# EAGLE design vco_main (EAGLE 7.2.0)
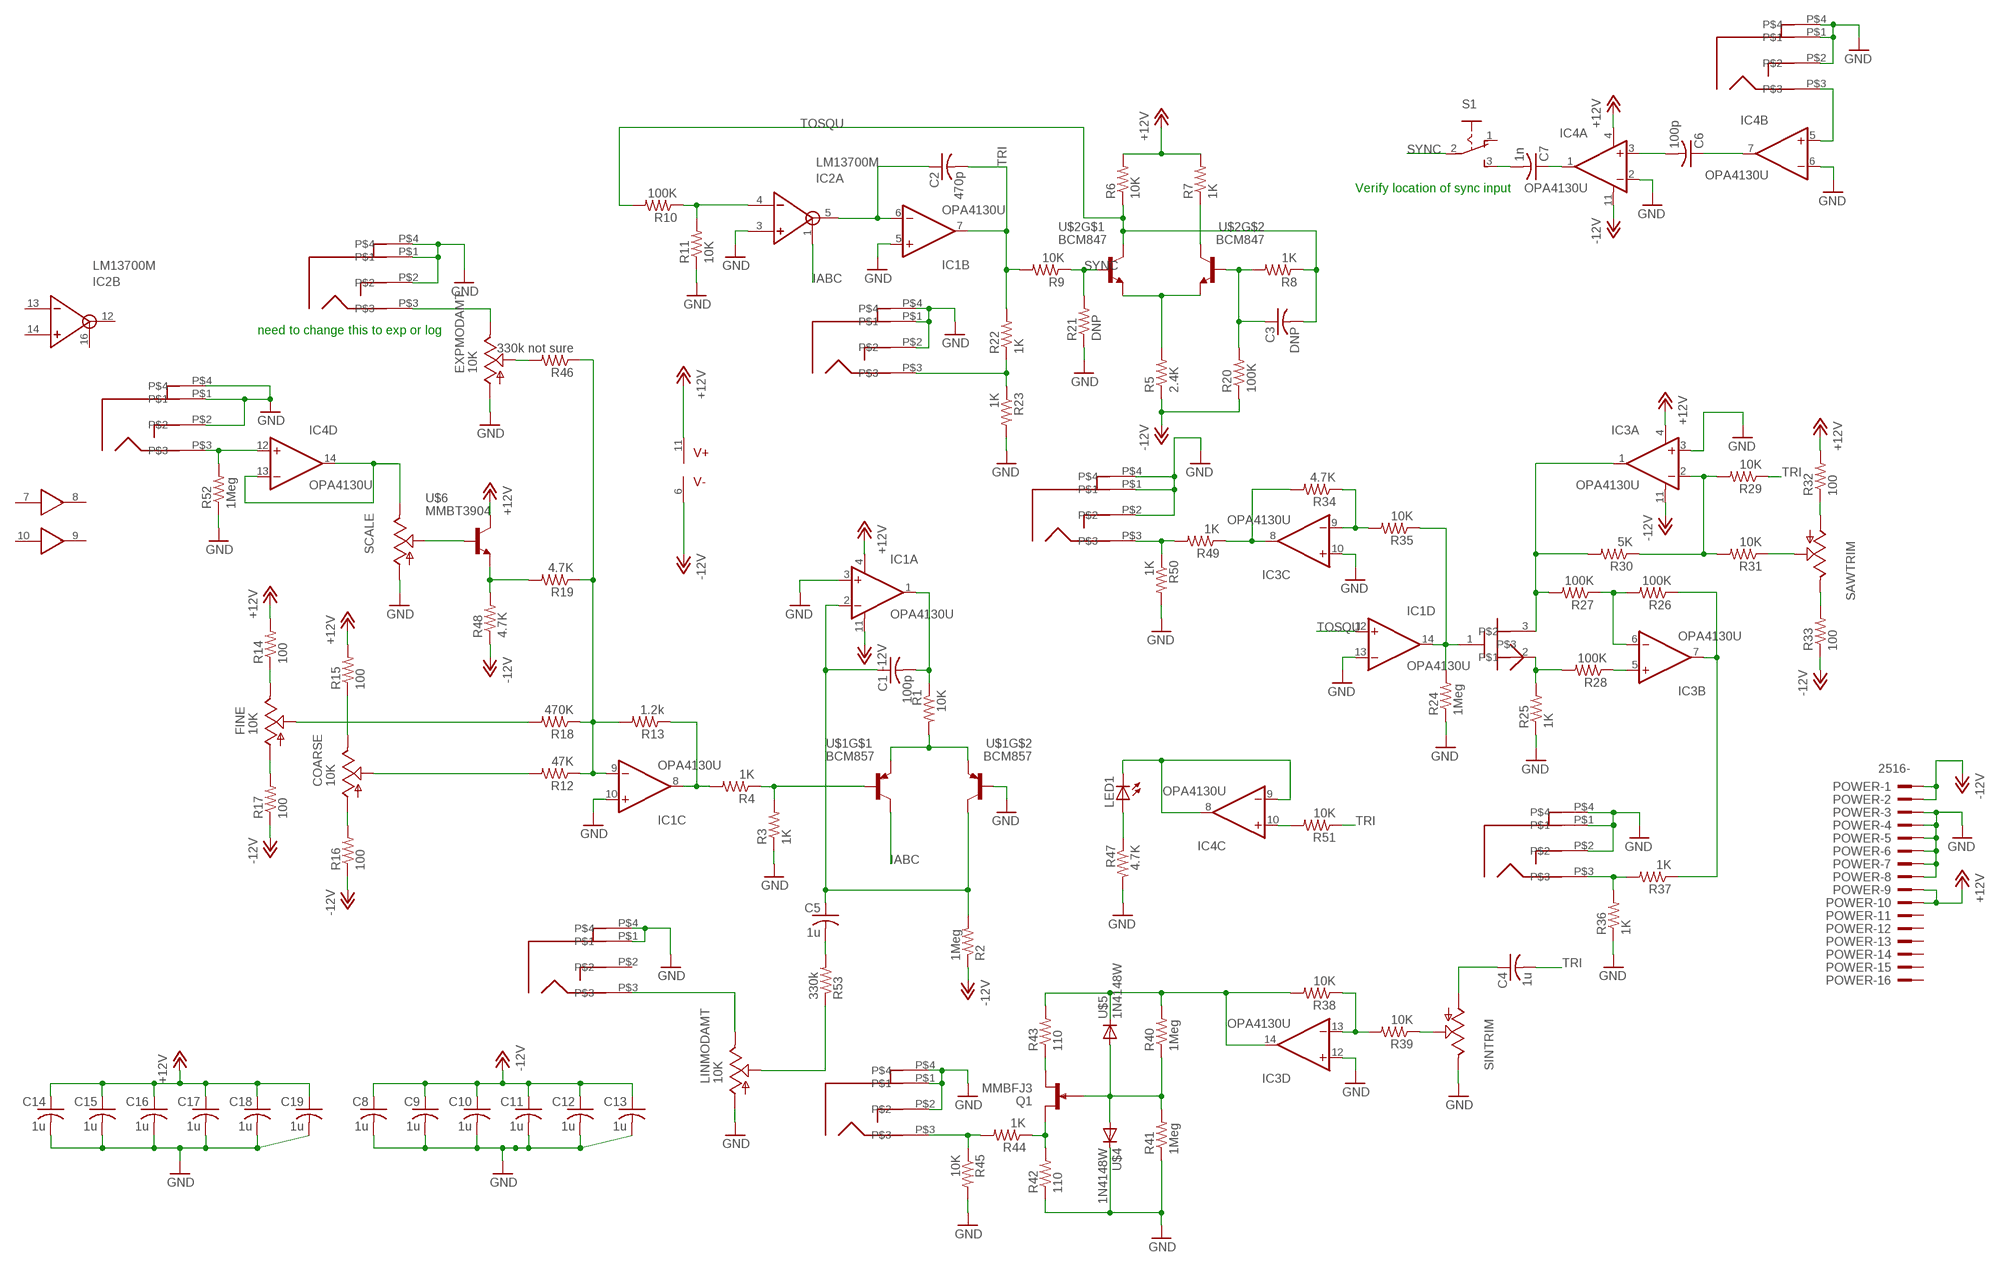
[diagram p0: schematic, sheet 1]

## Parts
C1  100p  C-USC0603  [C0603]
C2  470p  C-USC0603  [C0603]
C3  DNP  C-USC0603  [C0603]
C4  1u  C-USC0603  [C0603]
C5  1u  C-USC0603  [C0603]
C6  100p  C-USC0603  [C0603]
C7  1n  C-USC0603  [C0603]
C8  1u  C-USC0603  [C0603]
C9  1u  C-USC0603  [C0603]
C10  1u  C-USC0603  [C0603]
C11  1u  C-USC0603  [C0603]
C12  1u  C-USC0603  [C0603]
C13  1u  C-USC0603  [C0603]
C14  1u  C-USC0603  [C0603]
C15  1u  C-USC0603  [C0603]
C16  1u  C-USC0603  [C0603]
C17  1u  C-USC0603  [C0603]
C18  1u  C-USC0603  [C0603]
C19  1u  C-USC0603  [C0603]
COARSE  10K  US-EVUF2J  [EVUFXJ]
EXPMOD  PJ301BM  [PJ301BM]
EXPMODAMT  10K  US-EVUF2J  [EVUFXJ]
FINE  10K  US-EVUF2J  [EVUFXJ]
IC1  OPA4130U  [SO14]
IC2  LM13700M  [SO16]
IC3  OPA4130U  [SO14]
IC4  OPA4130U  [SO14]
LED1  LED5MM  [LED5MM]
LINMOD  PJ301BM  [PJ301BM]
LINMODAMT  10K  US-EVUF2J  [EVUFXJ]
POWER  2516-  [PAK100/2500-16]
Q1  MMBFJ3  [SOT23]
R1  10K  R-US_R0603  [R0603]
R2  1Meg  R-US_R0603  [R0603]
R3  1K  R-US_R0603  [R0603]
R4  1K  R-US_R0603  [R0603]
R5  2.4K  R-US_R0603  [R0603]
R6  10K  R-US_R0603  [R0603]
R7  1K  R-US_R0603  [R0603]
R8  1K  R-US_R0603  [R0603]
R9  10K  R-US_R0603  [R0603]
R10  100K  R-US_R0603  [R0603]
R11  10K  R-US_R0603  [R0603]
R12  47K  R-US_R0603  [R0603]
R13  1.2k  R-US_R0603  [R0603]
R14  100  R-US_R0603  [R0603]
R15  100  R-US_R0603  [R0603]
R16  100  R-US_R0603  [R0603]
R17  100  R-US_R0603  [R0603]
R18  470K  R-US_R0603  [R0603]
R19  4.7K  R-US_R0603  [R0603]
R20  100K  R-US_R0603  [R0603]
R21  DNP  R-US_R0603  [R0603]
R22  1K  R-US_R0603  [R0603]
R23  1K  R-US_R0603  [R0603]
R24  1Meg  R-US_R0603  [R0603]
R25  1K  R-US_R0603  [R0603]
R26  100K  R-US_R0603  [R0603]
R27  100K  R-US_R0603  [R0603]
R28  100K  R-US_R0603  [R0603]
R29  10K  R-US_R0603  [R0603]
R30  5K  R-US_R0603  [R0603]
R31  10K  R-US_R0603  [R0603]
R32  100  R-US_R0603  [R0603]
R33  100  R-US_R0603  [R0603]
R34  4.7K  R-US_R0603  [R0603]
R35  10K  R-US_R0603  [R0603]
R36  1K  R-US_R0603  [R0603]
R37  1K  R-US_R0603  [R0603]
R38  10K  R-US_R0603  [R0603]
R39  10K  R-US_R0603  [R0603]
R40  1Meg  R-US_R0603  [R0603]
R41  1Meg  R-US_R0603  [R0603]
R42  110  R-US_R0603  [R0603]
R43  110  R-US_R0603  [R0603]
R44  1K  R-US_R0603  [R0603]
R45  10K  R-US_R0603  [R0603]
R46  330k not sure  R-US_R0603  [R0603]
R47  4.7K  R-US_R0603  [R0603]
R48  4.7K  R-US_R0603  [R0603]
R49  1K  R-US_R0603  [R0603]
R50  1K  R-US_R0603  [R0603]
R51  10K  R-US_R0603  [R0603]
R52  1Meg  R-US_R0603  [R0603]
R53  330k  R-US_R0603  [R0603]
S1  255SB  [255SB]
SAW  PJ301BM  [PJ301BM]
SAWTRIM  TRIM_US-B64Y  [B64Y]
SCALE  TRIM_US-B64Y  [B64Y]
SIN  PJ301BM  [PJ301BM]
SINTRIM  TRIM_US-B64Y  [B64Y]
SQUARE  PJ301BM  [PJ301BM]
SYNC  PJ301BM  [PJ301BM]
TRIOUT  PJ301BM  [PJ301BM]
U$1  BCM857  [SOT457R_PHILIPS]
U$2  BCM847  [SOT457R_PHILIPS]
U$3  2N7000  [SOT23]
U$4  1N4148W  [SOD123]
U$5  1N4148W  [SOD123]
U$6  MMBT3904  [SOT23]
VPEROCT  PJ301BM  [PJ301BM]

## Nets
+12V: C14.1 C15.1 C16.1 C17.1 C18.1 C19.1 IC1.4(A:V+) IC2.11(V+) IC3.4(A:V+) IC4.4(A:V+) POWER.9 POWER.10 R6.2 R7.2 R14.2 R15.2 R32.2 U$6.3(C)
-12V: C8.1 C9.1 C10.1 C11.1 C12.1 C13.1 IC1.11(A:V-) IC2.6(V-) IC3.11(A:V-) IC4.11(A:V-) POWER.1 POWER.2 R2.1 R5.1 R16.1 R17.1 R20.1 R33.1 R48.1
GND: C8.2 C9.2 C10.2 C11.2 C12.2 C13.2 C14.2 C15.2 C16.2 C17.2 C18.2 C19.2 EXPMOD.P$1 EXPMOD.P$2 EXPMOD.P$4 EXPMODAMT.1(A) IC1.3(A:+IN) IC1.5(B:+IN) IC1.10(C:+IN) IC1.13(D:-IN) IC2.3(A:+IN) IC3.3(A:+IN) IC3.10(C:+IN) IC3.12(D:+IN) IC4.2(A:-IN) IC4.6(B:-IN) LINMOD.P$1 LINMOD.P$4 LINMODAMT.1(A) POWER.3 POWER.4 POWER.5 POWER.6 POWER.7 POWER.8 R3.1 R11.1 R21.1 R23.2 R24.1 R25.1 R36.1 R41.1 R42.1 R45.2 R47.2 R50.2 R52.1 SAW.P$1 SAW.P$2 SAW.P$4 SCALE.A SIN.P$1 SIN.P$2 SIN.P$4 SINTRIM.E SQUARE.P$1 SQUARE.P$2 SQUARE.P$4 SYNC.P$1 SYNC.P$2 SYNC.P$4 TRIOUT.P$1 TRIOUT.P$2 TRIOUT.P$4 U$1.5(B) U$4.C VPEROCT.P$1 VPEROCT.P$2 VPEROCT.P$4
IABC: IC2.1(A:IABC) U$1.6(C)
N$1: LED1.A R47.1
N$2: C1.2 IC1.1(A:OUT) R1.1
N$3: C1.1 C5.1 IC1.2(A:-IN) R2.2 U$1.3(C)
N$4: C3.1 R8.2 R20.2 U$2.5(B)
N$5: IC1.9(C:-IN) R12.1 R13.2 R18.1 R19.1 R46.1
N$6: C6.2 IC4.3(A:+IN)
N$7: R3.2 R4.1 U$1.2(B)
N$8: FINE.3(E) R14.1
N$9: R49.2 R50.1 SQUARE.P$3
N$10: R25.2 R28.2 U$3.2
N$11: R5.2 U$2.1(E) U$2.4(E)
N$12: R1.2 U$1.1(E) U$1.4(E)
N$13: R22.1 R23.1 TRIOUT.P$3
N$14: IC2.4(A:-IN) R10.1 R11.2
N$15: IC1.8(C:OUT) R4.2 R13.1
N$16: COARSE.3(E) R15.1
N$17: COARSE.1(A) R16.2
N$18: COARSE.2(S) R12.2
N$19: C2.1 IC1.6(B:-IN) IC2.5(A:OUT)
N$20: FINE.1(A) R17.2
N$21: FINE.2(S) R18.2
N$22: R19.2 R48.2 U$6.2(E)
N$23: R7.1 U$2.3(C)
N$24: LINMOD.P$3 LINMODAMT.3(E)
N$25: IC3.5(B:+IN) R28.1
N$26: IC3.6(B:-IN) R26.2 R27.1
N$27: IC3.7(B:OUT) R26.1 R37.1
N$28: IC3.1(A:OUT) R27.2 R30.2 U$3.3
N$29: R32.1 SAWTRIM.A
N$30: IC3.2(A:-IN) R29.2 R30.1 R31.2
N$31: R33.2 SAWTRIM.E
N$32: R31.1 SAWTRIM.S
N$33: R36.2 R37.2 SAW.P$3
N$34: IC3.9(C:-IN) R34.1 R35.2
N$35: C4.1 SINTRIM.A
N$36: IC3.8(C:OUT) R34.2 R49.1
N$37: Q1.3(G) R40.1 R41.2 U$4.A U$5.A
N$38: IC3.13(D:-IN) R38.1 R39.2
N$39: R39.1 SINTRIM.S
N$40: R44.2 R45.1 SIN.P$3
N$41: IC3.14(D:OUT) R38.2 R40.2 R43.2 U$5.C
N$42: EXPMODAMT.2(S) R46.2
N$43: Q1.1(D) R42.2 R44.1
N$44: Q1.2(S) R43.1
N$45: EXPMOD.P$3 EXPMODAMT.3(E)
N$46: LINMODAMT.2(S) R53.1
N$47: C6.1 IC4.7(B:OUT)
N$48: C5.2 R53.2
N$49: C7.1 IC4.1(A:OUT)
N$50: IC4.5(B:+IN) SYNC.P$3
N$51: C7.2 S1.3(S)
N$52: IC4.8(C:OUT) IC4.9(C:-IN) LED1.K(C)
N$54: IC4.12(D:+IN) R52.2 VPEROCT.P$3
N$55: IC4.13(D:-IN) IC4.14(D:OUT) SCALE.E
N$56: SCALE.S U$6.1(B)
N$57: IC1.14(D:OUT) R24.2 R35.1 U$3.1
N$59: IC4.10(C:+IN) R51.2
SYNC: R9.1 R21.2 S1.2(P) U$2.2(B)
TOSQU: C3.2 IC1.12(D:+IN) R6.1 R8.1 R10.2 U$2.6(C)
TRI: C2.2 C4.2 IC1.7(B:OUT) R9.2 R22.2 R29.1 R51.1
Unconnected: IC2.7(IN) IC2.8(OUT) IC2.9(OUT) IC2.10(IN) IC2.12(B:OUT) IC2.13(B:-IN) IC2.14(B:+IN) IC2.16(B:IABC) LINMOD.P$2 POWER.11 POWER.12 POWER.13 POWER.14 POWER.15 POWER.16 S1.1(O)

## Notes on the sheet
- Verify location of sync input
- need to change this to exp or log

## Library data of the parts
C1-C19 = dan:C-US: CAPACITOR, American symbol
COARSE EXPMODAMT FINE LINMODAMT = dan:US-EVU: 9 mm Square Rotary Potentiometers Source: Panasonic
EXPMOD LINMOD SAW SIN SQUARE SYNC TRIOUT VPEROCT = dan:PJ301BM
IC1 IC3 IC4 = dan:OPA4130: Low Power, Precision FET-Input Operational Amplifiers; MF: TEXAS INSTRUMENTS; MPN: OPA4130UA; OC_FARNELL: 1648707; OC_NEWARK: 80K8080
IC2 = dan:LM13700: National Dual OTA with buffers.
LED1 = dan:LED: LED OSRAM: - CHIPLED LG R971, LG N971, LY N971, LG Q971, LY Q971, LO R971, LY R971 LH N974, LH R974 LS Q976, LO Q976, LY Q976 LO Q996 - Hyper CHIPLED LW Q18S LB Q993, LB Q99A, LB R99A - SideLED LS A670, LO A670, LY A670, LG A670, LP A670 LB A673, LV A673, LT A673, LW A673 LH A674 LY A675 LS A676, LA A676, LO A676, LY A676, LW A676 LS A679, LY A679, LG A679 - Hyper Micro SIDELED® LS Y876, LA Y876, LO Y876, LY Y876 LT Y87S - SmartLED LW L88C, LW L88S LB L89C, LB L89S, LG L890 LS L89K, LO L89K, LY L89K LS L896, LA L896, LO L896, LY L896 - TOPLED LS T670, LO T670, LY T670, LG T670, LP T670 LSG T670, LSP T670, LSY T670, LOP T670, LYG T670 LG T671, LOG T671, LSG T671 LB T673, LV T673, LT T673, LW T673 LH T674 LS T676, LA T676, LO T676, LY T676, LB T676, LH T676, LSB T676, LW T676 LB T67C, LV T67C, LT T67C, LS T67K, LO T67K, LY T67K, LW E67C LS E67B, LA E67B, LO E67B, LY E67B, LB E67C, LV E67C, LT E67C LW T67C LS T679, LY T679, LG T679 LS T770, LO T770, LY T770, LG T770, LP T770 LB T773, LV T773, LT T773, LW T773 LH T774 LS E675, LA E675, LY E675, LS T675 LS T776, LA T776, LO T776, LY T776, LB T776 LHGB T686 LT T68C, LB T68C - Hyper Mini TOPLED® LB M676 - Mini TOPLED Santana® LG M470 LS M47K, LO M47K, LY M47K Source: http://www.osram.convergy.de LUXEON: - LUMILED® LXK2-PW12-R00, LXK2-PW12-S00, LXK2-PW14-U00, LXK2-PW14-V00 LXK2-PM12-R00, LXK2-PM12-S00, LXK2-PM14-U00 LXK2-PE12-Q00, LXK2-PE12-R00, LXK2-PE12-S00, LXK2-PE14-T00, LXK2-PE14-U00 LXK2-PB12-K00, LXK2-PB12-L00, LXK2-PB12-M00, LXK2-PB14-N00, LXK2-PB14-P00, LXK2-PB14-Q00 LXK2-PR12-L00, LXK2-PR12-M00, LXK2-PR14-Q00, LXK2-PR14-R00 LXK2-PD12-Q00, LXK2-PD12-R00, LXK2-PD12-S00 LXK2-PH12-R00, LXK2-PH12-S00 LXK2-PL12-P00, LXK2-PL12-Q00, LXK2-PL12-R00 Source: www.luxeon.com KINGBRIGHT: KA-3528ASYC Source: www.kingbright.com
POWER = dan:2516-: 3M (TM) Pak 100 4-Wall Header Source: 3M; OC_FARNELL: unknown; OC_NEWARK: unknown
Q1 = dan:MMBFJ3*: N-Channel RF Amplifier Source: http://www.fairchildsemi.com/pf/J3/J310.html
R1-R53 = dan:R-US_: RESISTOR, American symbol
S1 = dan:255SB: SLIDING SWITCH Distributor Buerklin, 11G810
SAWTRIM SCALE SINTRIM = dan:TRIM_US-: POTENTIOMETER
U$1 = dan:BCM857
U$2 = dan:BCM847
U$3 = dan:2N7000
U$4 U$5 = dan:1N4148W
U$6 = dan:MMBT3904

## Board
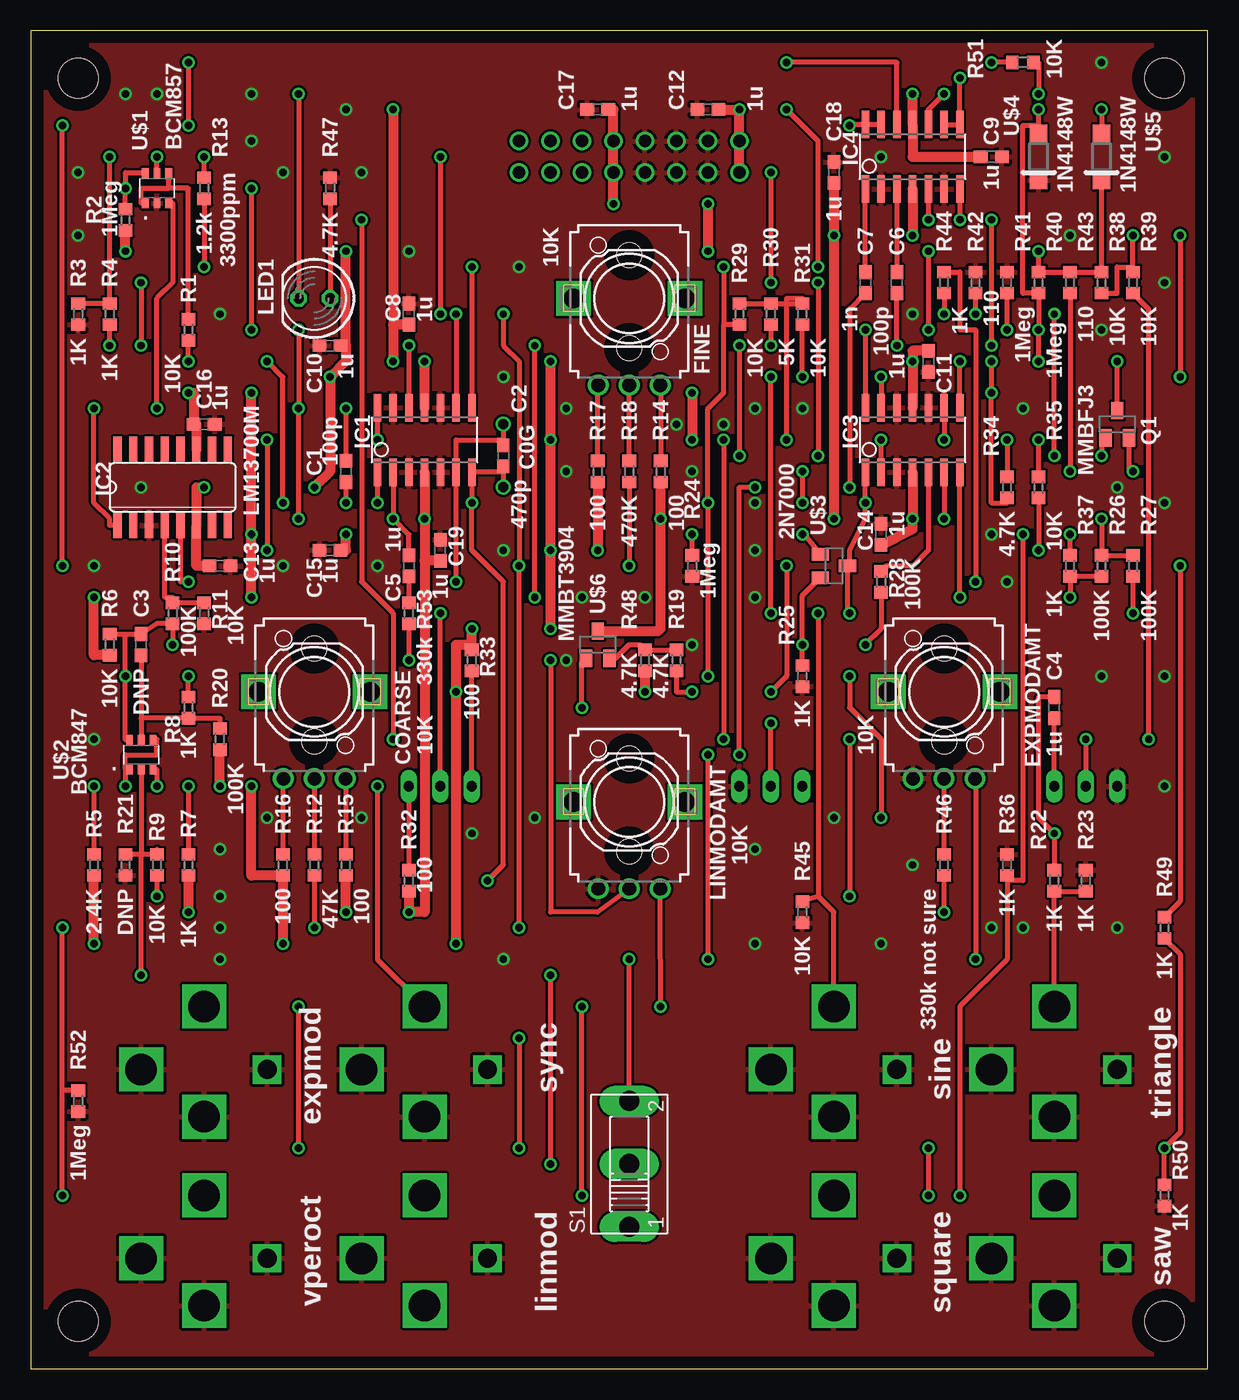
[diagram p1: board, top side]
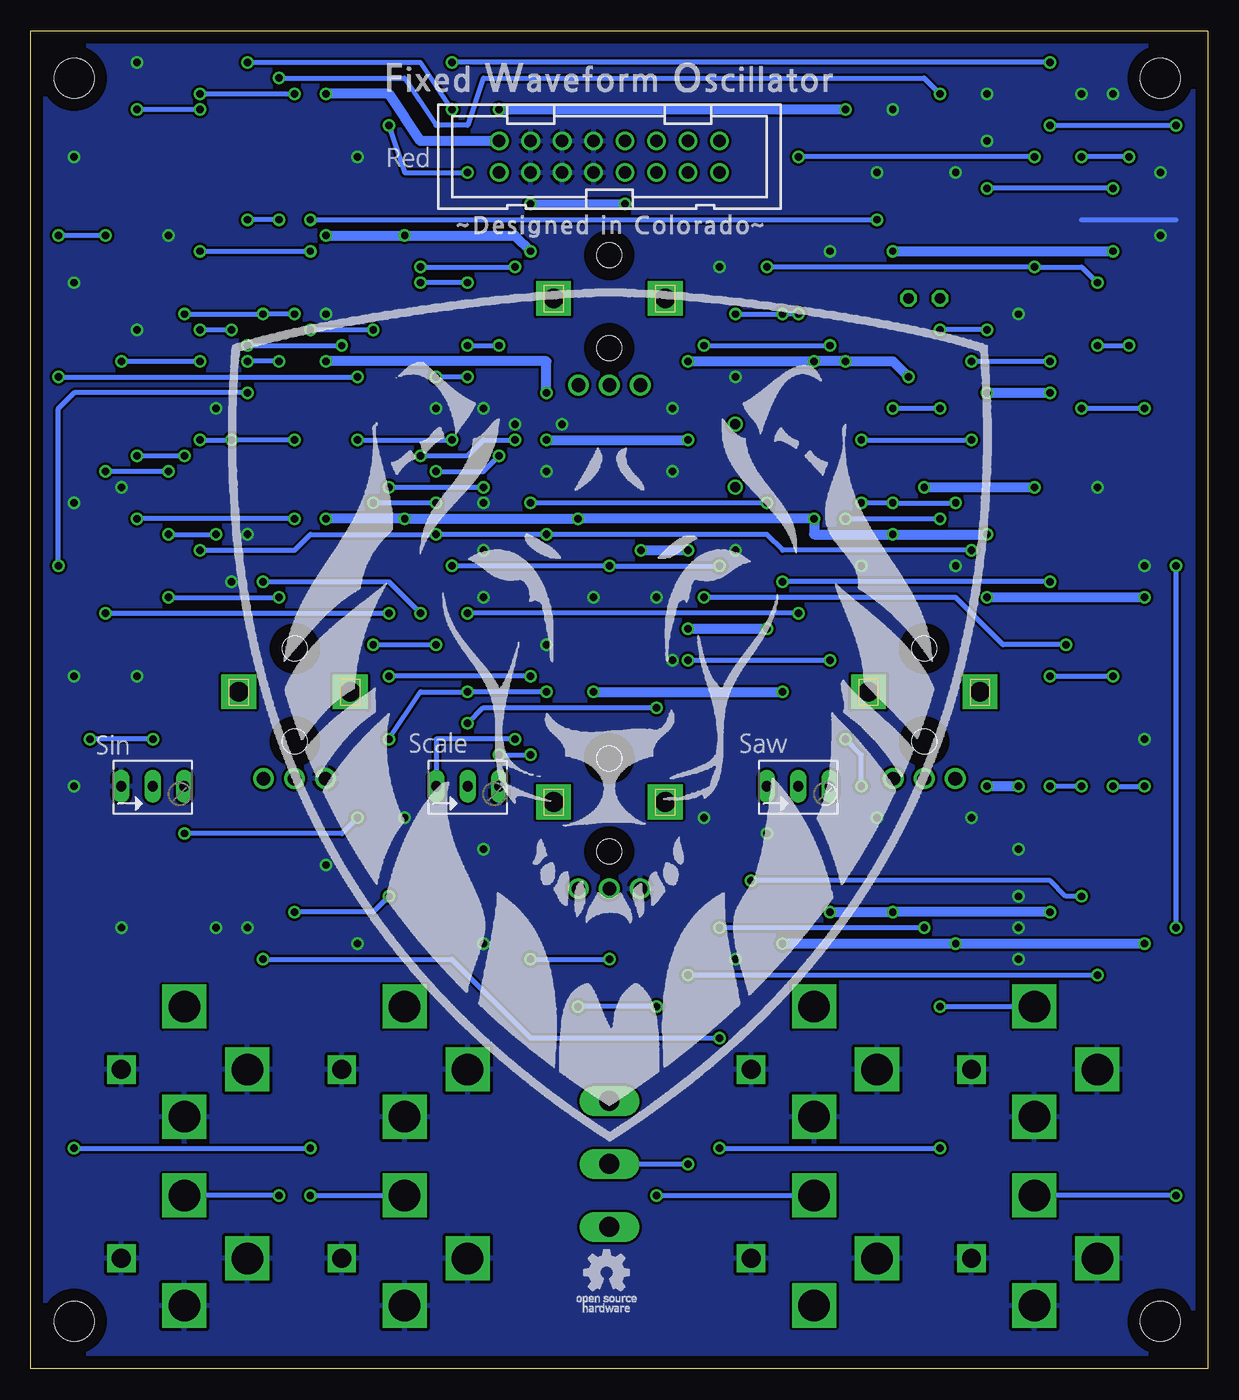
[diagram p2: board, bottom side, seen from below]

Size 94.92 x 107.94 mm. Coordinates in mm from the lower left corner, seen from the top.
Outline: 0,107.94 94.92,107.94 94.92,0 0,0 0,107.94
Copper layers (1*16): Top 0.035mm / dielectric 1.5mm / Bottom 0.035mm
Design rules "default *": minimum track width 10mil, minimum drill 20mil, track to track 8mil, track to pad 8mil, pad to pad 8mil, via to via 8mil, smd to smd 8mil, copper to edge 40mil, drill to drill 8mil, minimum pad ring 10mil, minimum via ring 8mil, stop-mask expansion 4mil, vias tented up to drill 0mil, thermal gap 10mil
Holes 3.2 mm at 3.81,3.81 91.44,3.81 3.81,104.14 91.44,104.14

### Footprints (pad centres in the part's own frame; a part is rotated, then mirrored left to right if it is on the bottom)
C0603 = smd 1.1 x 1: 1 -0.85,0; 2 0.85,0
EVUFXJ = drill 1.1 pad 1.676: 1 -2.5,-7; 2 0,-7; 3 2.5,-7 | drill 1.6 pad 2.8 square: M1 4.5,0; M2 -4.5,0 | hole 2: 0,3.5; 0,-4
PJ301BM = drill 1.524 square: P$1 5.08,0 | drill 2.54 square: P$2 0,-3.81; P$3 0,5.08; P$4 -5.08,0
SO14 = smd 0.61 x 2.21: 1 -3.81,-2.603; 2 -2.54,-2.603; 3 -1.27,-2.603; 4 0,-2.603; 5 1.27,-2.603; 6 2.54,-2.603; 7 3.81,-2.603; 8 3.81,2.603; 9 2.54,2.603; 10 1.27,2.603; 11 0,2.603; 12 -1.27,2.603; 13 -2.54,2.603; 14 -3.81,2.603
SO16 = smd 0.66 x 2.032: 1 -4.445,-3.073; 2 -3.175,-3.073; 3 -1.905,-3.073; 4 -0.635,-3.073; 5 0.635,-3.073; 6 1.905,-3.073; 7 3.175,-3.073; 8 4.445,-3.073; 9 4.445,3.073; 10 3.175,3.073; 11 1.905,3.073; 12 0.635,3.073; 13 -0.635,3.073; 14 -1.905,3.073; 15 -3.175,3.073; 16 -4.445,3.073
LED5MM = drill 0.813 octagon: A -1.27,0; K 1.27,0
PAK100/2500-16 = drill 1 pad 1.422: 1 -8.89,-1.27; 2 -8.89,1.27; 3 -6.35,-1.27; 4 -6.35,1.27; 5 -3.81,-1.27; 6 -3.81,1.27; 7 -1.27,-1.27; 8 -1.27,1.27; 9 1.27,-1.27; 10 1.27,1.27; 11 3.81,-1.27; 12 3.81,1.27; 13 6.35,-1.27; 14 6.35,1.27; 15 8.89,-1.27; 16 8.89,1.27
SOT23 = smd 1 x 1.4: 1 -0.95,-1.1; 2 0.95,-1.1; 3 0,1.1
R0603 = smd 1 x 1.1: 1 -0.85,0; 2 0.85,0
255SB = drill 1.6 long: 1 -5.08,0; 2 0,0; 3 5.08,0
B64Y = drill 0.813 long: A 2.54,0; E -2.54,0; S 0,0
SOT457R_PHILIPS = smd 0.55 x 0.8: 1 -0.95,-1.2; 2 0,-1.2; 3 0.95,-1.2; 4 0.95,1.2; 5 0,1.2; 6 -0.95,1.2
SOD123 = smd 1.4 x 1.4: A 1.9,0; C -1.9,0

### Placement (x,y rotation side)
C1  25.4,72.39 270 top
C2  38.1,73.66 270 top
C3  8.89,58.42 90 top
C4  82.55,53.34 90 top
C5  30.48,64.77 270 top
C6  69.85,87.63 90 top
C7  67.31,87.63 270 top
C8  30.48,85.09 90 top
C9  77.47,97.79 0 top
C10  24.13,82.55 180 top
C11  72.39,81.28 270 top
C12  54.61,101.6 180 top
C13  15.24,64.77 0 top
C14  68.58,67.31 90 top
C15  24.13,66.04 180 top
C16  13.97,76.2 0 top
C17  45.72,101.6 180 top
C18  64.77,96.52 90 top
C19  33.02,66.04 90 top
COARSE  22.86,54.61 0 top
EXPMOD  13.97,24.13 0 top
EXPMODAMT  73.66,54.61 0 top
FINE  48.26,86.36 0 top
IC1  31.75,74.93 0 top
IC2  11.43,71.12 0 top
IC3  71.12,74.93 0 top
IC4  71.12,97.79 0 top
LED1  22.86,86.36 180 top
LINMOD  31.75,8.89 0 top
LINMODAMT  48.26,45.72 0 top
POWER  48.26,97.79 0 bottom
Q1  87.63,76.2 0 top
R1  12.7,83.82 90 top
R2  7.62,92.71 90 top
R3  3.81,85.09 90 top
R4  6.35,85.09 270 top
R5  5.08,40.64 90 top
R6  6.35,58.42 270 top
R7  12.7,40.64 270 top
R8  12.7,53.34 270 top
R9  10.16,40.64 270 top
R10  11.43,60.96 270 top
R11  13.97,60.96 90 top
R12  22.86,40.64 90 top
R13  13.97,95.25 90 top
R14  50.8,72.39 270 top
R15  25.4,40.64 270 top
R16  20.32,40.64 90 top
R17  45.72,72.39 90 top
R18  48.26,72.39 90 top
R19  52.07,57.15 90 top
R20  15.24,50.8 90 top
R21  7.62,40.64 90 top
R22  82.55,39.37 90 top
R23  85.09,39.37 90 top
R24  53.34,64.77 90 top
R25  62.23,55.88 90 top
R26  86.36,64.77 90 top
R27  88.9,64.77 270 top
R28  68.58,63.5 270 top
R29  57.15,85.09 90 top
R30  59.69,85.09 270 top
R31  62.23,85.09 90 top
R32  30.48,39.37 270 top
R33  35.56,57.15 270 top
R34  78.74,71.12 270 top
R35  81.28,71.12 90 top
R36  78.74,40.64 270 top
R37  83.82,64.77 90 top
R38  86.36,87.63 90 top
R39  88.9,87.63 90 top
R40  81.28,87.63 90 top
R41  78.74,87.63 270 top
R42  76.2,87.63 270 top
R43  83.82,87.63 90 top
R44  73.66,87.63 90 top
R45  62.23,36.83 270 top
R46  73.66,40.64 90 top
R47  24.13,95.25 90 top
R48  49.53,57.15 90 top
R49  91.44,35.56 270 top
R50  91.44,13.97 270 top
R51  80.01,105.41 0 top
R52  3.81,21.59 90 top
R53  30.48,60.96 90 top
S1  48.26,16.51 90 top
SAW  82.55,8.89 0 top
SAWTRIM  33.02,46.99 0 bottom
SCALE  59.69,46.99 0 bottom
SIN  64.77,24.13 0 top
SINTRIM  85.09,46.99 0 bottom
SQUARE  64.77,8.89 0 top
SYNC  31.75,24.13 0 top
TRIOUT  82.55,24.13 0 top
U$1  10.16,95.25 180 top
U$2  8.89,49.53 0 top
U$3  64.77,64.77 270 top
U$4  81.28,97.79 90 top
U$5  86.36,97.79 90 top
U$6  45.72,58.42 0 top
VPEROCT  13.97,8.89 0 top

### Tracks (layer width: path | path; a pad name or v marks a point on that pad's centre or on a via)
+12V  (via drill 0.6)
  Top 0.406: C15.1 25.4,66.04 | C16.1 13.34,76.2 | v12.7,78.74 13.12,78.74 | 50.63,59.52 50.8,59.69
  Top 0.813: IC1.4 v31.75,68.58 31.75,65.19 | R14.2 v50.8,68.58 50.8,59.69 | IC3.4 v71.12,68.58 71.12,67.73 C14.1 | IC4.4 v71.12,91.44 | v64.77,68.58 v64.77,91.44 C18.1 | 31.75,65.19 31.75,36.83 v30.48,36.83 R32.2 | v25.4,36.83 R15.2 | R7.2 v12.7,36.83 | v46.99,93.98 POWER.9 POWER.10 46.99,101.6 C17.1 | 25.4,66.04 v25.4,67.31 | C19.1 31.75,65.19 | 13.34,76.2 IC2.11 | v17.78,78.74 v17.78,67.31 v17.78,62.23 | 13.12,78.74 C16.1 | v54.61,93.98 v54.61,90.17 | R6.2 5.08,57.57 v5.08,62.23 | U$6.3 50.63,59.52
  Bottom 0.813: v71.12,91.44 v64.77,91.44 55.88,91.44 v54.61,90.17 | v71.12,68.58 v64.77,68.58 v50.8,68.58 v31.75,68.58 31.75,67.31 v25.4,67.31 v17.78,67.31 | v30.48,36.83 v25.4,36.83 v12.7,36.83 | v54.61,93.98 v46.99,93.98 | v17.78,78.74 v12.7,78.74 | v5.08,62.23 v17.78,62.23
-12V  (via drill 0.6)
  Top 0.406: v13.97,71.12 13.34,71.12 | C10.1 25.4,82.55 | 20.32,38.1 R16.1
  Top 0.813: IC1.11 v31.75,81.28 | IC3.11 v71.12,81.28 71.12,82.13 C11.1 | v5.08,34.29 R5.1 | v20.32,34.29 R16.1 17.78,39.79 v17.78,46.99 | R33.1 35.56,58.42 | 35.56,58.42 v35.56,59.69 | v41.91,59.69 v41.91,66.04 v41.91,74.93 v41.91,81.28 | v71.12,102.87 IC4.11 71.12,97.79 C9.1 | v29.21,101.6 29.21,84.24 | 29.21,84.24 v29.21,81.28 | v34.29,34.29 v34.29,54.61 34.29,58.42 35.56,58.42 | v53.34,78.74 v53.34,74.93 | POWER.1 POWER.2 v57.15,101.6 C12.1 | C8.1 29.21,84.24 | 13.34,71.12 IC2.6 13.34,64.77 C13.1 | v25.4,90.17 25.4,82.55 25.4,81.28 v24.13,80.01 24.13,72.39 v22.86,71.12 | v7.62,90.17 R2.1 | v15.24,46.99 R20.1 | R17.1 v45.72,66.04 | R48.1 v49.53,54.61
  Bottom 0.813: v5.08,34.29 v20.32,34.29 v34.29,34.29 | v35.56,59.69 v41.91,59.69 | v41.91,81.28 v31.75,81.28 v29.21,81.28 25.4,81.28 v24.13,80.01 | v53.34,74.93 v41.91,74.93 | v22.86,71.12 v13.97,71.12 | v25.4,90.17 v7.62,90.17 | v29.21,101.6 v57.15,101.6 | v53.34,78.74 53.34,81.28 v71.12,81.28 | v15.24,46.99 v17.78,46.99 | v45.72,66.04 v41.91,66.04 | POWER.2 63.5,99.06 66.04,102.87 v71.12,102.87 | v49.53,54.61 v34.29,54.61
GND  (via drill 0.6)
  Top 0.406: R3.1 3.81,83.82
  Bottom 0.406: 10.16,92.71 2.54,92.71
  other vias: 58.42,77.47 62.23,77.47 30.48,90.17 86.36,83.82 35.56,43.18 55.88,76.2 38.1,80.01 39.37,88.9 25.4,101.6 17.78,102.87 10.16,102.87 3.81,96.52 3.81,91.44 91.44,97.79 86.36,105.41 83.82,91.44 77.47,35.56 86.36,55.88 40.64,44.45 44.45,62.23 49.53,62.23 5.08,50.8 80.01,35.56 53.34,72.39 80.01,77.47 52.07,76.2 26.67,44.45 19.05,44.45 17.78,99.06 26.67,96.52 8.89,71.12 68.58,97.79 20.32,96.52 15.24,85.09 7.62,102.87 77.47,67.31 58.42,69.85 20.32,64.77 27.94,64.77 71.12,40.64 5.08,64.77 58.42,66.04 58.42,62.23 78.74,63.5 43.18,77.47 43.18,72.39 91.44,46.99 71.12,85.09 87.63,71.12 53.34,58.42 43.18,57.15 38.1,66.04 91.44,69.85 91.44,55.88 58.42,41.91 68.58,34.29 15.24,41.91 91.44,87.63 15.24,33.02 15.24,35.56 15.24,38.1 64.77,44.45 58.42,34.29 38.1,33.02 87.63,35.56
  pour Top: -3.81,107.95 100.33,109.22 97.79,-2.54 -5.08,-3.81
  pour Bottom: -7.62,109.22 97.79,110.49 103.05,-4.31 -12.7,-8.89
IABC  (via drill 0.6)
  Top 0.406: IC2.1 6.35,68.05 6.35,68.58 5.08,69.85 v5.08,77.47 | v10.16,77.47 10.16,86.36 11.43,87.63 11.43,94.05 U$1.6
  Bottom 0.406: v5.08,77.47 v10.16,77.47
N$1
  Top 0.406: R47.1 LED1.A
N$2  (via drill 0.6)
  Top 0.406: IC1.1 v27.94,69.85 | C1.2 v25.4,69.85 | v20.32,69.85 20.32,80.01 v19.05,81.28 | v12.7,81.28 R1.1
  Bottom 0.406: v20.32,69.85 v25.4,69.85 v27.94,69.85 | v19.05,81.28 v12.7,81.28
N$3  (via drill 0.6)
  Top 0.406: IC1.2 v29.21,68.58 30.48,67.31 C5.1 | v21.59,68.58 v21.59,77.47 v21.59,83.82 | v25.4,77.47 C1.1 | R2.2 v7.62,95.25 7.62,96.45 | v17.78,95.25 v17.78,83.82 | U$1.3 7.62,96.45 | 7.62,96.45 7.62,96.52
  Bottom 0.406: v29.21,68.58 v21.59,68.58 | v21.59,77.47 v25.4,77.47 | v7.62,95.25 v17.78,95.25 | v17.78,83.82 v21.59,83.82
N$4
  Top 0.406: 8.89,52.49 R8.2 15.24,52.49 R20.2 | 8.89,52.49 U$2.5 | C3.1 8.89,52.49
N$5  (via drill 0.6)
  Top 0.406: v33.02,97.79 v33.02,85.09 | v34.29,85.09 IC1.9 | R18.1 v48.26,64.77 | R12.1 v22.86,35.56 | v39.37,35.56 v39.37,64.77 39.37,81.28 38.1,82.55 v38.1,85.09 | v66.04,50.8 v66.04,38.1 | R13.2 v13.97,97.79 | v73.66,36.83 R46.1 | R19.1 52.07,54.61 v53.34,54.61 | v60.96,64.77 60.96,55.88 v59.69,54.61
  Bottom 0.406: v13.97,97.79 v33.02,97.79 | v33.02,85.09 v34.29,85.09 v38.1,85.09 | v39.37,64.77 v48.26,64.77 v60.96,64.77 | v22.86,35.56 v39.37,35.56 | v53.34,54.61 v59.69,54.61 63.5,54.61 v66.04,50.8 | v66.04,38.1 67.31,36.83 v73.66,36.83
N$6
  Top 0.406: IC4.3 C6.2
N$7  (via drill 0.6)
  Top 0.406: R3.2 R4.1 v6.35,97.79 | U$1.2 v10.16,97.79
  Bottom 0.406: v6.35,97.79 v10.16,97.79
N$8
  Top 0.406: R14.1 50.8,78.09 FINE.3
N$9  (via drill 0.6)
  Top 0.406: R49.2 92.71,33.44 92.71,19.05 v91.44,17.78 R50.1 | v72.39,17.78 v72.39,13.97
  Bottom 0.406: v91.44,17.78 v72.39,17.78 | v72.39,13.97 SQUARE.P$3
N$10  (via drill 0.6)
  Top 0.406: R28.2 68.58,59.69 v67.31,58.42 | U$3.2 62.23,62.38 v62.23,58.42 R25.2
  Bottom 0.406: v67.31,58.42 v62.23,58.42
N$11  (via drill 0.6)
  Top 0.406: 7.62,48.33 v7.62,46.99 | v5.08,46.99 R5.2 | U$2.1 7.62,48.33 | 7.62,48.33 7.62,49.53 10.16,49.53 10.16,50.8 9.84,50.8 U$2.4
  Bottom 0.406: v7.62,46.99 v5.08,46.99
N$12
  Top 0.406: U$1.4 8.89,94.05 8.89,95.25 11.11,95.25 | 11.11,95.25 U$1.1 | R1.2 12.7,95.25 11.11,95.25
N$13
  Top 0.406: TRIOUT.P$3 R22.1 R23.1
N$14
  Top 0.406: R11.2 R10.1 11.43,62.23 10.79,62.23 IC2.4
N$15  (via drill 0.6)
  Top 0.406: R13.1 v13.97,88.9 | v8.89,87.63 v8.89,82.55 | v6.35,82.55 R4.2 | v35.56,88.9 IC1.8
  Bottom 0.406: v8.89,82.55 v6.35,82.55 | v35.56,88.9 v13.97,88.9 10.16,88.9 v8.89,87.63
N$16
  Top 0.406: COARSE.3 25.4,47.61 R15.1
N$17
  Top 0.406: R16.2 20.36,41.49 COARSE.1
N$18
  Top 0.406: COARSE.2 R12.2
N$19  (via drill 0.6, 0.8)
  Top 0.406: v12.7,63.5 12.06,63.5 IC2.5 | v34.29,63.5 IC1.6 34.29,74.93 37.68,74.93 | 37.68,74.93 38.1,74.93 v38.1,76.2 | 37.68,74.93 C2.1
  Bottom 0.406: v12.7,63.5 v34.29,63.5
N$20
  Top 0.406: R17.2 45.72,78.74 45.76,78.74 FINE.1
N$21
  Top 0.406: R18.2 FINE.2
N$22
  Top 0.406: U$6.2 47.16,57.32 48.26,58.42 49.11,58.42 R48.2 R19.2
N$23  (via drill 0.6)
  Top 0.406: U$2.3 10.16,48.33 v10.16,46.99 | v12.7,46.99 R7.1
  Bottom 0.406: v10.16,46.99 v12.7,46.99
N$24  (via drill 0.6)
  Top 0.406: v44.45,13.97 v44.45,29.21 | v50.8,29.21 50.76,36.83 LINMODAMT.3
  Bottom 0.406: v44.45,29.21 v50.8,29.21 | v44.45,13.97 LINMOD.P$3
N$25
  Top 0.406: IC3.5 72.39,66.04 71.12,64.77 69,64.77 R28.1
N$26  (via drill 0.6)
  Top 0.406: IC3.6 v73.66,68.58 | v86.36,68.58 R26.2 R27.1
  Bottom 0.406: v73.66,68.58 v86.36,68.58
N$27  (via drill 0.6)
  Top 0.406: v83.82,62.23 R37.1 R26.1 | v74.93,62.23 IC3.7
  Bottom 0.406: v83.82,62.23 v74.93,62.23
N$28  (via drill 0.6)
  Top 0.406: R27.2 v88.9,60.96 | R30.2 v59.69,82.55 | v57.15,82.55 v57.15,73.66 | IC3.1 v67.31,69.85 67.31,68.58 66.04,66.04 66.04,64.77 U$3.3 65.87,60.96 v66.04,60.96 | v62.23,72.39 v62.23,69.85
  Bottom 0.406: v88.9,60.96 v66.04,60.96 | v59.69,82.55 v57.15,82.55 | v62.23,69.85 v67.31,69.85 | v62.23,72.39 58.42,72.39 v57.15,73.66
N$29
  Top 0.406: SAWTRIM.A R32.1
N$30  (via drill 0.6)
  Top 0.406: R29.2 R30.1 R31.2 62.23,86.36 60.96,86.36 v60.96,74.93 | IC3.2 v68.58,74.93
  Bottom 0.406: v68.58,74.93 v60.96,74.93
N$31
  Top 0.406: SAWTRIM.E R33.2
N$32  (via drill 0.6)
  Top 0.406: SAWTRIM.S v33.02,60.96 | v59.69,60.96 v59.69,80.01 | v62.23,80.01 R31.1
  Bottom 0.406: v33.02,60.96 v59.69,60.96 | v59.69,80.01 v62.23,80.01
N$33  (via drill 0.6)
  Top 0.406: R37.2 v83.82,67.31 | v80.01,67.31 80.01,39.37 78.74,39.37 | R36.2 78.74,39.37 | 78.74,39.37 78.74,33.02 74.93,29.21 v74.93,13.97
  Bottom 0.406: v83.82,67.31 v80.01,67.31 | v74.93,13.97 SAW.P$3
N$34  (via drill 0.6)
  Top 0.406: R35.2 v81.28,74.93 | v78.74,74.93 R34.1 | 73.66,78.74 IC3.9 v73.66,74.93
  Bottom 0.406: v81.28,74.93 v78.74,74.93 v73.66,74.93
N$35
  Top 0.406: SINTRIM.A C4.1
N$36  (via drill 0.6)
  Top 0.406: IC3.8 v74.93,81.28 | v77.47,81.28 v77.47,78.74 77.47,69.85 78.74,69.85 R34.2 | v92.71,64.77 92.71,37.68 R49.1
  Bottom 0.406: v74.93,81.28 v77.47,81.28 | v77.47,78.74 91.44,78.74 92.71,77.47 v92.71,64.77
N$37  (via drill 0.6)
  Top 0.406: U$4.A 81.28,100.33 | 81.28,100.33 v81.28,101.6 | v86.36,101.6 U$5.A | v78.74,83.82 R41.2 | 81.28,100.33 80.01,100.33 80.01,86.78 R40.1 v81.28,83.82 v81.28,81.28 | Q1.3 v87.63,81.28
  Bottom 0.406: v81.28,101.6 v86.36,101.6 | v81.28,83.82 v78.74,83.82 | v87.63,81.28 v81.28,81.28
N$38  (via drill 0.6)
  Top 0.406: v88.9,91.44 R39.2 88.9,88.9 87.63,88.9 87.63,86.78 R38.1 | v92.71,91.44 v92.71,80.01 | v68.58,80.01 IC3.13
  Bottom 0.406: v88.9,91.44 v92.71,91.44 | v92.71,80.01 v68.58,80.01
N$39  (via drill 0.6)
  Top 0.406: R39.1 90.17,85.51 v90.17,50.8 | v85.09,50.8 SINTRIM.S
  Bottom 0.406: v85.09,50.8 v90.17,50.8
N$40  (via drill 0.6)
  Top 0.406: R44.2 74.93,88.48 74.93,83.82 76.2,83.82 v76.2,63.5 | v63.5,60.96 63.5,38.1 | 63.5,38.1 R45.1 | SIN.P$3 64.77,36.83 63.5,38.1
  Bottom 0.406: v76.2,63.5 66.04,63.5 v63.5,60.96
N$41  (via drill 0.6)
  Top 0.406: U$5.C R38.2 R43.2 R40.2 v81.28,90.17 | v72.39,90.17 v72.39,83.82 | v67.31,83.82 IC3.14
  Bottom 0.406: v81.28,90.17 v72.39,90.17 | v72.39,83.82 v67.31,83.82
N$42
  Top 0.406: R46.2 EXPMODAMT.2
N$43  (via drill 0.6)
  Top 0.406: Q1.1 86.36,75.1 v86.36,73.66 | v82.55,73.66 v82.55,85.09 | v76.2,85.09 R42.2 | R44.1 v73.66,85.09
  Bottom 0.406: v86.36,73.66 v82.55,73.66 | v82.55,85.09 v76.2,85.09 v73.66,85.09
N$44  (via drill 0.6)
  Top 0.406: R43.1 v83.82,72.39 | v88.9,72.39 88.58,72.39 Q1.2
  Bottom 0.406: v83.82,72.39 v88.9,72.39
N$45  (via drill 0.6)
  Top 0.406: v76.2,33.02 76.2,47.61 EXPMODAMT.3 | v21.59,17.78 v21.59,29.21 | v39.37,26.67 v39.37,17.78
  Bottom 0.406: v39.37,17.78 v21.59,17.78 | v21.59,29.21 EXPMOD.P$3 | v76.2,33.02 60.96,33.02 54.61,26.67 v39.37,26.67
N$46  (via drill 0.6)
  Top 0.406: R53.1 v30.48,57.15 | v41.91,57.15 41.91,36.83 45.72,36.83 LINMODAMT.2
  Bottom 0.406: v30.48,57.15 v41.91,57.15
N$47  (via drill 0.6)
  Top 0.406: IC4.7 v74.93,92.71 | v77.47,92.71 v77.47,82.55 | v69.85,82.55 C6.1
  Bottom 0.406: v74.93,92.71 v77.47,92.71 | v77.47,82.55 v69.85,82.55
N$48
  Top 0.406: C5.2 R53.2
N$49
  Top 0.406: C7.1 IC4.1
N$50  (via drill 0.6)
  Top 0.406: 72.39,95.25 IC4.5 v72.39,92.71 | v26.67,92.71 26.67,63.5 29.21,60.96 v29.21,50.8 | SYNC.P$3 27.94,33.02 v27.94,46.99
  Bottom 0.406: v72.39,92.71 v26.67,92.71 | v27.94,46.99 27.94,49.53 v29.21,50.8
N$51  (via drill 0.6)
  Top 0.406: C7.2 66.04,85.51 v66.04,71.12 | v57.15,49.53 57.15,71.12 v58.42,71.12 | v54.61,49.53 v54.61,33.02 | S1.3 v48.26,33.02
  Bottom 0.406: v66.04,71.12 v58.42,71.12 | v57.15,49.53 v54.61,49.53 | v54.61,33.02 v48.26,33.02
N$52  (via drill 0.6)
  Top 0.406: IC4.9 IC4.8 v74.93,104.14 | v21.59,102.87 LED1.K
  Bottom 0.406: v21.59,102.87 22.86,104.14 58.42,104.14 59.69,100.33 62.23,100.33 64.77,104.14 v74.93,104.14
N$54  (via drill 0.6)
  Top 0.406: v12.7,105.41 v12.7,100.33 | R52.2 2.54,22.44 | v2.54,13.97 2.54,22.44 | 2.54,22.44 v2.54,35.56 | v2.54,64.77 v2.54,100.33 | IC4.12 69.85,105.41 v60.96,105.41
  Bottom 0.406: v12.7,100.33 v2.54,100.33 | v2.54,13.97 VPEROCT.P$3 | v2.54,35.56 v2.54,64.77 | v12.7,105.41 v60.96,105.41
N$55  (via drill 0.6)
  Top 0.406: IC4.13 IC4.14 66.04,100.39 v66.04,100.33 | v59.69,96.52 v59.69,87.63 | v63.5,87.63 v63.5,73.66 | v55.88,74.93 v55.88,50.8
  Bottom 0.406: v59.69,87.63 v63.5,87.63 | v63.5,73.66 59.69,73.66 58.42,74.93 v55.88,74.93 | v55.88,50.8 62.23,50.8 SCALE.E | v66.04,100.33 64.77,96.52 v59.69,96.52
N$56  (via drill 0.6)
  Top 0.406: SCALE.S v59.69,52.07 | v44.45,53.34 44.45,57 U$6.1
  Bottom 0.406: v59.69,52.07 58.42,53.34 v44.45,53.34
N$57  (via drill 0.6)
  Top 0.406: IC1.14 v27.94,74.93 | v19.05,74.93 v19.05,66.04 | v62.23,67.31 62.4,67.31 U$3.1 | R24.2 v53.34,67.31 | R35.1 v81.28,66.04
  Bottom 0.406: v27.94,74.93 v19.05,74.93 | v19.05,66.04 34.29,66.04 35.56,67.31 v53.34,67.31 v62.23,67.31 72.39,67.31 73.66,66.04 v81.28,66.04
N$59  (via drill 0.6)
  Top 0.406: R51.2 81.28,105.41 v81.28,102.87 | IC4.10 72.39,101.6 v73.66,102.87
  Bottom 0.406: v81.28,102.87 v73.66,102.87
SYNC  (via drill 0.6)
  Top 0.406: U$2.2 8.89,41.49 | 10.16,41.91 R9.1 8.89,41.49 | 8.89,41.49 R21.2 | v41.91,16.51 v41.91,31.75 | v8.89,31.75 8.89,41.49
  Bottom 0.406: v41.91,31.75 v8.89,31.75 | S1.2 v41.91,16.51
TOSQU  (via drill 0.6)
  Top 0.406: R6.1 7.62,59.27 | 7.62,59.27 C3.2 10.16,60.11 R10.2 v11.43,58.42 | U$2.6 7.62,50.73 v7.62,55.88 7.62,59.27 | R8.1 v12.7,55.88 | v40.64,62.23 v40.64,82.55 | v30.48,82.55 IC1.12
  Bottom 0.406: v12.7,55.88 v7.62,55.88 | v11.43,58.42 16.51,58.42 20.32,62.23 v40.64,62.23 | v40.64,82.55 v30.48,82.55
TRI  (via drill 0.6, 0.8)
  Top 0.406: R29.1 55.88,84.24 | v55.88,88.9 55.88,84.24 | v54.61,55.88 v54.61,69.85 54.61,77.47 55.88,78.74 55.88,84.24 | R51.1 v77.47,105.41 | 38.1,72.39 35.56,72.39 IC1.7 v35.56,69.85 35.56,66.04 38.1,63.5 38.1,40.64 v36.83,39.37 | 38.1,72.39 C2.2 | C4.2 81.28,54.19 81.28,44.45 v82.55,43.18 R22.2 | R9.2 v10.16,38.1 | v66.04,55.88 66.04,53.34 68.58,50.8 v68.58,44.45 | v63.5,88.9 63.5,99.06 v60.96,101.6 | 38.1,72.39 v38.1,71.12
  Bottom 0.406: v35.56,69.85 v54.61,69.85 | v63.5,88.9 v55.88,88.9 | v77.47,105.41 63.5,105.41 v60.96,101.6 | v10.16,38.1 11.43,38.1 12.7,39.37 v36.83,39.37 | v54.61,55.88 v66.04,55.88 | v68.58,44.45 69.85,43.18 v82.55,43.18

### Text on the board
tPlace: 3300ppm | . | C0G | . | expmod | triangle | sync | sine | vperoct | linmod | square | saw